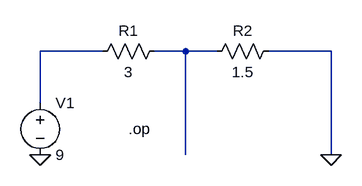
[diagram p0: schematic vd3.asc]
vd3.asc, the LTspice schematic file:
Version 4
SHEET 1 880 680
WIRE 336 256 240 256
WIRE 464 256 416 256
WIRE 512 256 464 256
WIRE 688 256 592 256
WIRE 240 336 240 256
WIRE 464 416 464 256
WIRE 688 416 688 256
FLAG 240 416 0
FLAG 688 416 0
SYMBOL voltage 240 320 R0
SYMATTR InstName V1
SYMATTR Value 9
SYMBOL Res 432 240 R90
WINDOW 0 0 56 VBottom 2
WINDOW 3 32 56 VTop 2
SYMATTR InstName R1
SYMATTR Value 3
SYMBOL Res 608 240 R90
WINDOW 0 0 56 VBottom 2
WINDOW 3 32 56 VTop 2
SYMATTR InstName R2
SYMATTR Value 1.5
TEXT 376 376 Left 2 !.op

The netlist it stands for:
* vd3.asc
V1 N001 0 9
R1 N002 N001 3
R2 0 N002 1.5
.op
.backanno
.end